# EAGLE design Schema 6 (EAGLE 9.6.2)
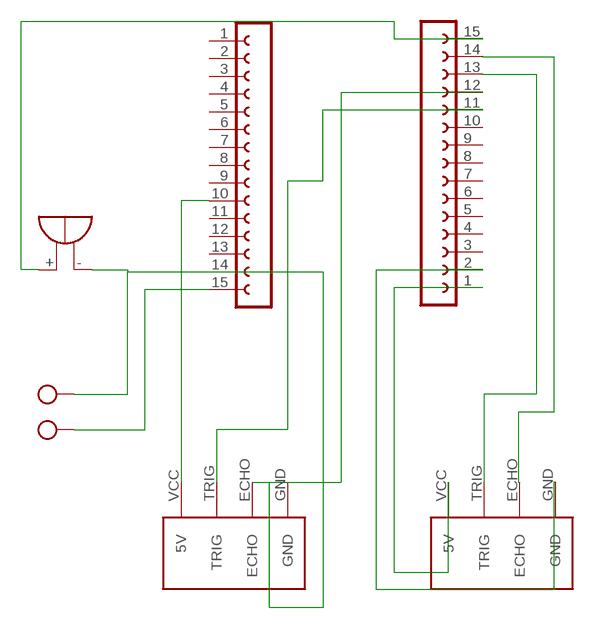
[diagram p0: schematic, sheet 1]

## Parts
J_ULTRASONIC_3  HC-SR04  [HC-SR04_FOOTPRINT]
J_ULTRASONIC_4  HC-SR04  [HC-SR04_FOOTPRINT]
SG2  EB2505  [EB2505]
SV1  FE15-1  [FE15]
SV2  FE15-1  [FE15]
X1  AK500/2-H  [AK500/2-H]

## Nets
N$1: J_ULTRASONIC_3.ECHO SV1.14
N$2: J_ULTRASONIC_3.TRIG SV1.13
N$3: J_ULTRASONIC_3.GND SV1.2
N$4: J_ULTRASONIC_3.VCC(5V) SV1.1
N$5: J_ULTRASONIC_4.GND SG2.- SV2.14 X1.1
N$6: SV2.15 X1.2
N$7: SG2.+ SV1.15
N$8: J_ULTRASONIC_4.ECHO SV1.12
N$9: J_ULTRASONIC_4.TRIG SV1.11
N$10: J_ULTRASONIC_4.VCC(5V) SV2.10
Unconnected: SV1.3 SV1.4 SV1.5 SV1.6 SV1.7 SV1.8 SV1.9 SV1.10 SV2.1 SV2.2 SV2.3 SV2.4 SV2.5 SV2.6 SV2.7 SV2.8 SV2.9 SV2.11 SV2.12 SV2.13

## Library data of the parts
J_ULTRASONIC_3 J_ULTRASONIC_4 = Ultrasonic Sensor HC-SR04:HC-SR04: Ultrasonic Sensor HC-SR04
SG2 = buzzer:EB2505: BUZZER Source: Buerklin; OC_FARNELL: unknown; OC_NEWARK: unknown
SV1 SV2 = con-lsta:FE15-1: FEMALE HEADER; OC_FARNELL: unknown; OC_NEWARK: unknown
X1 = con-ptr500:AK500/2-H: CONNECTOR Aug. 2004 / PTR Meßtechnik: Die Bezeichnung der Serie AK505 wurde geändert. Es handelt sich hierbei um AK500 in horizontaler Ausführung.; OC_FARNELL: unknown; OC_NEWARK: unknown

## Board
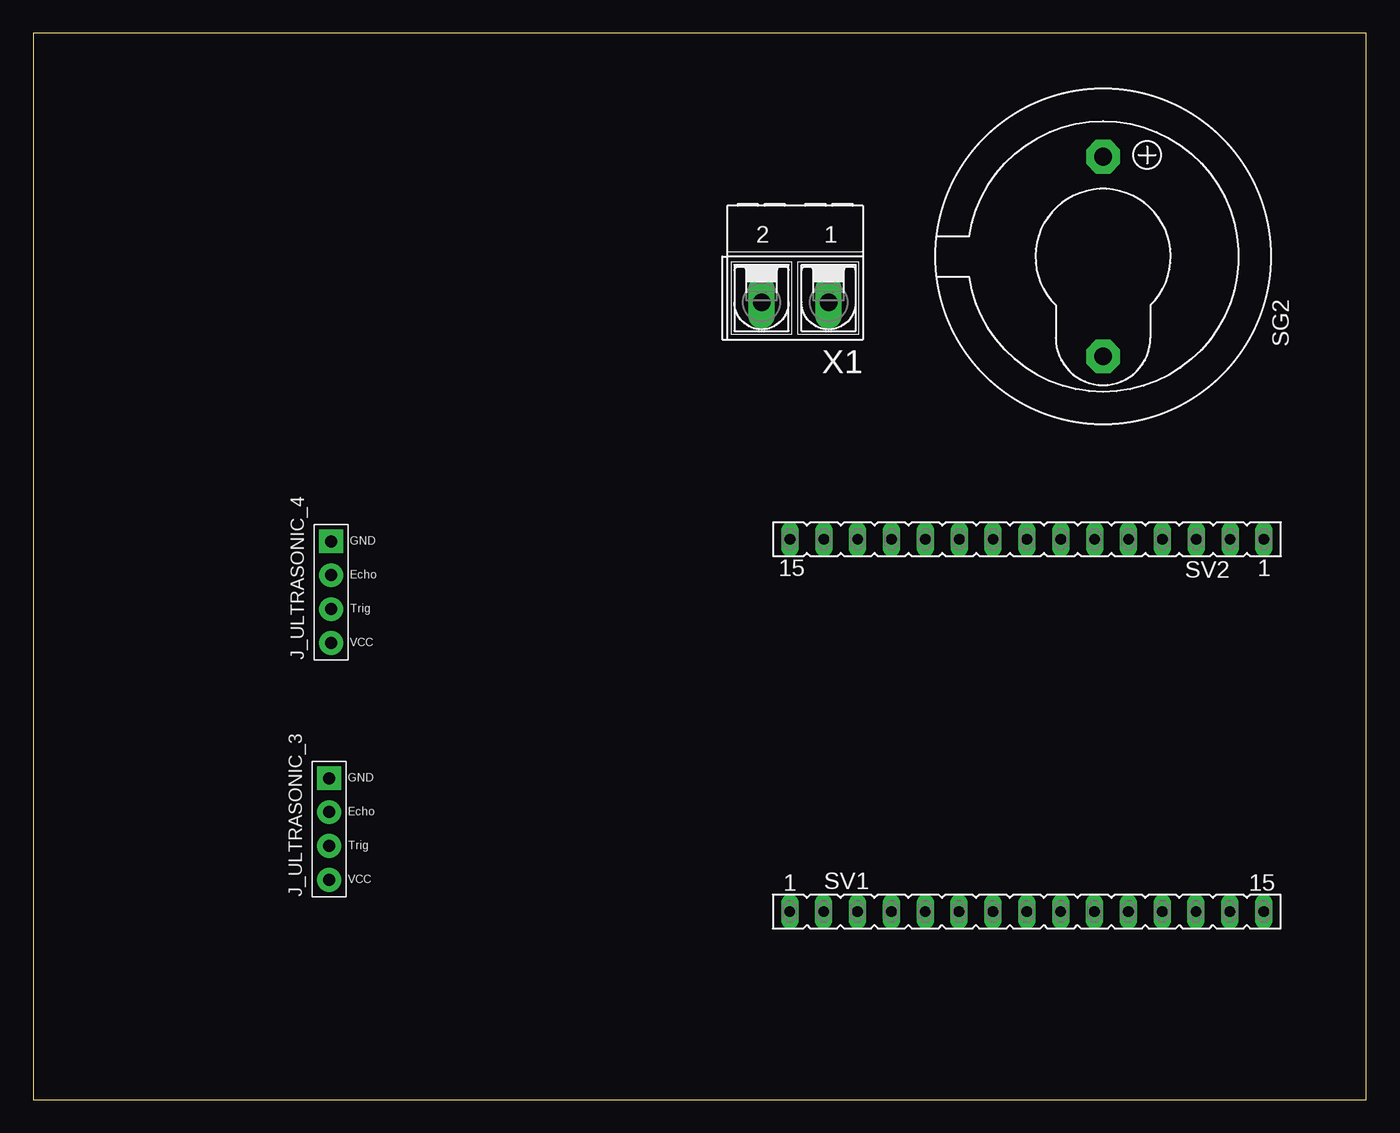
[diagram p1: board, top side]
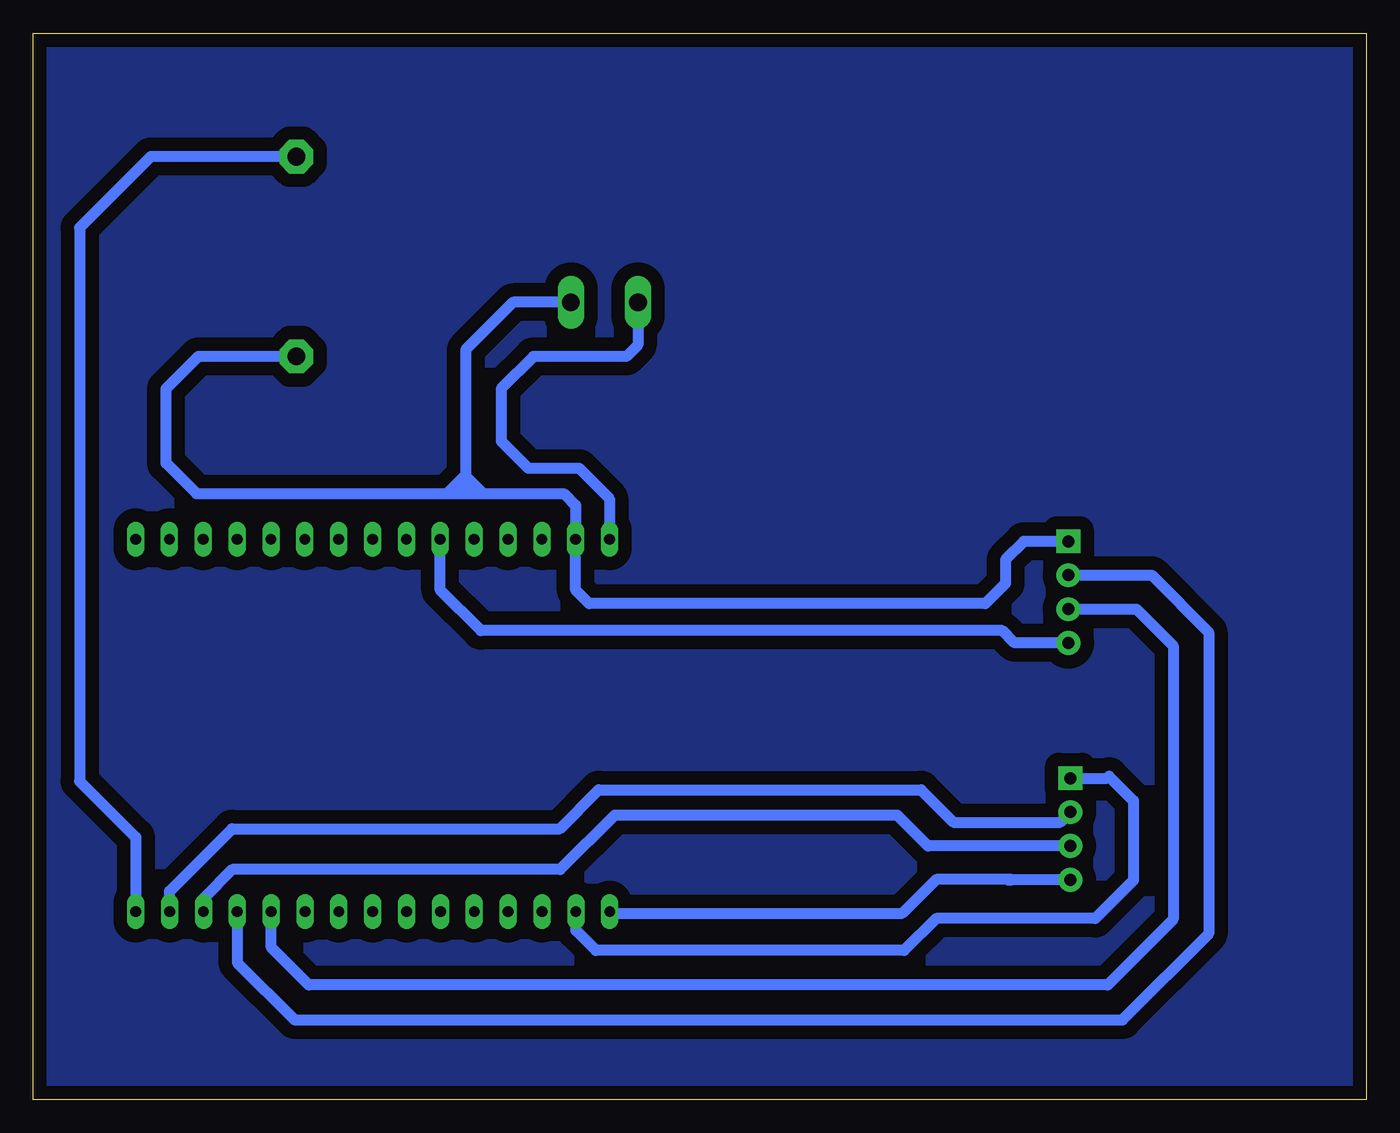
[diagram p2: board, bottom side, seen from below]

Size 100 x 80 mm. Coordinates in mm from the lower left corner, seen from the top.
Outline: 0,0 100,0 100,80 0,80 0,0
Copper layers (1*16): Top 0.035mm / dielectric 1.5mm / Bottom 0.035mm
Design rules "default *": minimum track width 6mil, minimum drill 0.35mm, track to track 40mil, track to pad 40mil, pad to pad 40mil, via to via 40mil, smd to smd 40mil, copper to edge 40mil, drill to drill 6mil, minimum pad ring 10mil, minimum via ring 8mil, stop-mask expansion 4mil, vias tented up to drill 0mil, thermal gap 10mil

### Footprints (pad centres in the part's own frame; a part is rotated, then mirrored left to right if it is on the bottom)
HC-SR04_FOOTPRINT = drill 0.9 pad 1.778: ECHO 0,1.27; TRIG 0,-1.27; VCC 0,-3.81 | drill 0.9 pad 1.778 square: GND 0,3.81
EB2505 = drill 1.321 pad 2.54 octagon: + -7.493,0; - 7.493,0
FE15 = drill 0.813 long: 1 -17.78,0; 2 -15.24,0; 3 -12.7,0; 4 -10.16,0; 5 -7.62,0; 6 -5.08,0; 7 -2.54,0; 8 0,0; 9 2.54,0; 10 5.08,0; 11 7.62,0; 12 10.16,0; 13 12.7,0; 14 15.24,0; 15 17.78,0
AK500/2-H = drill 1.321 long: 1 -2.515,0; 2 2.515,0

### Placement (x,y rotation side)
J_ULTRASONIC_3  22.19,20.3 0 top
J_ULTRASONIC_4  22.34,38.07 0 top
SG2  80.26,63.25 270 top
SV1  74.54,14.1 0 top
SV2  74.55,42.04 180 top
X1  57.15,59.82 180 top

### Tracks (layer width: path | path; a pad name or v marks a point on that pad's centre or on a via)
N$1
  Bottom 0.813: SV1.14 89.78,15.63 85.08,20.32 60.5,20.32 57.59,23.23 33.39,23.23 30.96,20.8 22.96,20.8 J_ULTRASONIC_3.ECHO
N$2
  Bottom 0.813: J_ULTRASONIC_3.TRIG 32.87,19.02 35.18,21.34 56.39,21.34 60.47,17.25 85.07,17.25 87.24,15.09 SV1.13
N$3
  Bottom 0.813: J_ULTRASONIC_3.GND 19.46,24.11 19.3,24.26 17.46,22.42 17.46,16.45 20.32,13.59 32.26,13.59 34.67,11.18 57.78,11.18 59.3,12.69 SV1.2
N$4
  Bottom 0.813: J_ULTRASONIC_3.VCC 26.54,16.48 | 26.95,16.48 26.54,16.48 | SV1.1 56.62,13.97 34.8,13.97 32.26,16.51 26.57,16.51 26.54,16.48
N$5
  Bottom 0.813: SG2.- 87.62,55.76 90.04,53.34 90.04,47.75 87.76,45.47 68.96,45.47 | 68.96,45.47 67.56,45.47 | 67.56,45.47 66.25,45.47 | 66.25,45.47 60.2,45.47 59.31,44.58 SV2.14 59.31,38.23 58.29,37.21 28.57,37.21 27.05,38.73 27.05,40.51 25.69,41.88 J_ULTRASONIC_4.GND | X1.1 64.01,59.82 67.56,56.26 67.56,46.86 | 67.56,46.86 67.56,46.74 | 67.56,46.74 67.56,45.47 | 66.25,45.47 67.52,46.74 67.56,46.74 | 67.56,46.86 68.96,45.47
N$6
  Bottom 0.813: X1.2 54.63,56.62 55.5,55.75 62.48,55.75 64.9,53.34 64.9,49.4 62.87,47.37 59.05,47.37 56.77,45.09 SV2.15
N$7
  Bottom 0.813: SG2.+ 91.18,70.75 96.52,65.41 96.52,23.88 92.32,19.67 SV1.15
N$8
  Bottom 0.813: J_ULTRASONIC_4.ECHO 16.1,39.34 11.81,35.05 11.81,12.45 18.29,5.97 80.39,5.97 84.7,10.27 SV1.12
N$9
  Bottom 0.813: J_ULTRASONIC_4.TRIG 17.24,36.8 14.48,34.04 14.48,13.52 19.4,8.6 79.34,8.6 82.16,11.42 SV1.11
N$10
  Bottom 0.813: J_ULTRASONIC_4.VCC 26.38,34.26 27.3,35.18 66.42,35.18 69.47,38.23 SV2.10
TST
  pour Bottom: 0,80 0,0 100,0 100,80